# EasyEDA schematic SCH_PCB-Card_2024-06-21.json
TITLE: Sheet_1; REV: 1.0; Date: 2024-06-20; Sheet: 1/1; Drawn By: flashonv9; Company: Your Company
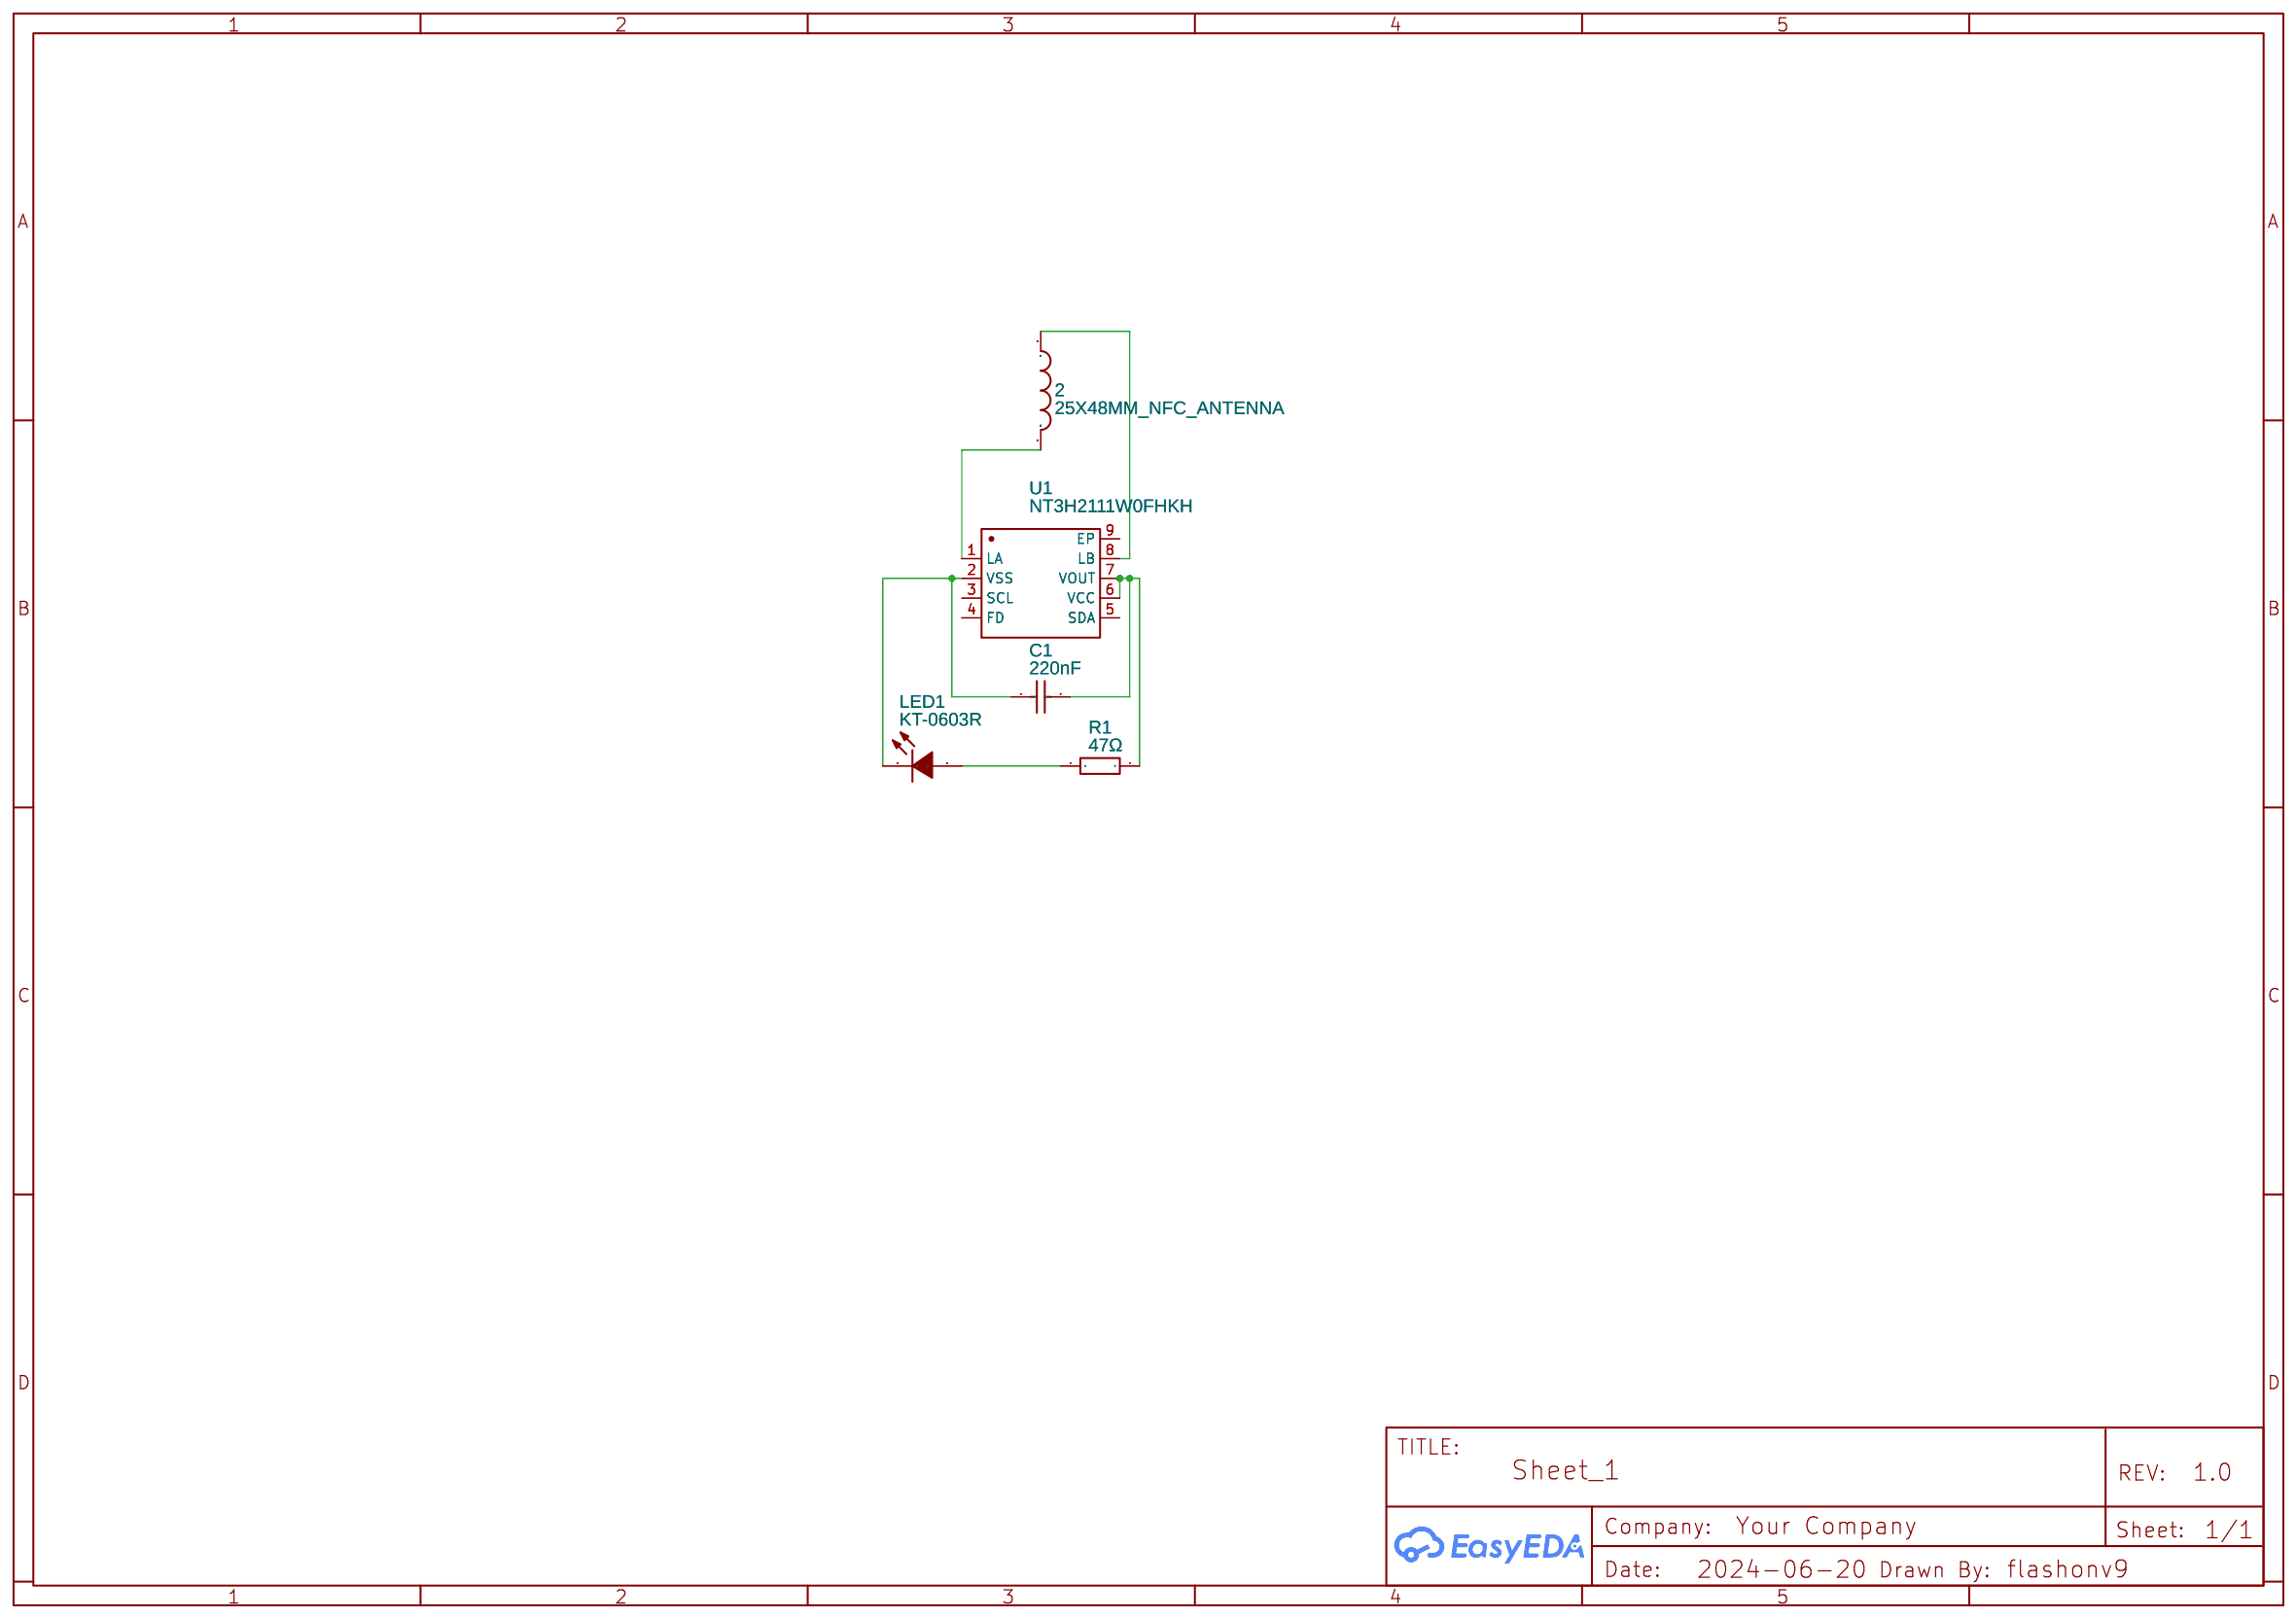
[diagram p0: schematic sheet]

## Parts
2  25X48MM_NFC_ANTENNA  [25X48MM_NFC]
C1  220nF  [C0603]
LED1  KT-0603R  [LED0603-RD]
R1  47Ω  [R0603]
U1  NT3H2111W0FHKH  [XQFN-8_L1.6-W1.6-P0.50-BL]

## Library data of the parts
2 = 25X48MM_NFC_ANTENNA: Contributor: srluo
C1 = CL10B224KA8NNNC: Supplier: LCSC; Manufacturer: SAMSUNG(三星); Supplier Part: C21120; JLCPCB Part Class: Basic Part
LED1 = KT-0603R: Supplier: LCSC; Manufacturer: KENTO; Supplier Part: C2286; JLCPCB Part Class: Basic Part
R1 = 0603WAF470JT5E: Supplier: LCSC; Manufacturer: UNI-ROYAL(厚声); Supplier Part: C23182; JLCPCB Part Class: Basic Part
U1 = NT3H2111W0FHKH: Contributor: LCSC; Supplier: LCSC; Supplier Part: C710403; Manufacturer: NXP(恩智浦); JLCPCB Part Class: Extended Part

## Nets
Net-(2-P$1): 2.P$1 U1.8(LB)
Net-(2-P$2): 2.P$2 U1.1(LA)
Net-(C1-1): C1.1 LED1.1(K) U1.2(VSS)
Net-(C1-2): C1.2 R1.2 U1.6(VCC) U1.7(VOUT)
Net-(LED1-2): LED1.2(A) R1.1

Not connected (* = marked no-connect by the designer): U1 3(SCL) 4(FD) 5(SDA) 9(EP)
